# EasyEDA Pro project 硬件.epro

# Schematic Schematic1
Board Name: Board1; Create Date: 2025-05-08; Page Name: P1; Project Name: TV-Pro双固件在线大模型小电视-修改; Schematic Name: Schematic1; Update Date: 2025-05-08; Company: 嘉立创EDA; Page Size: A4; Version: V1.0
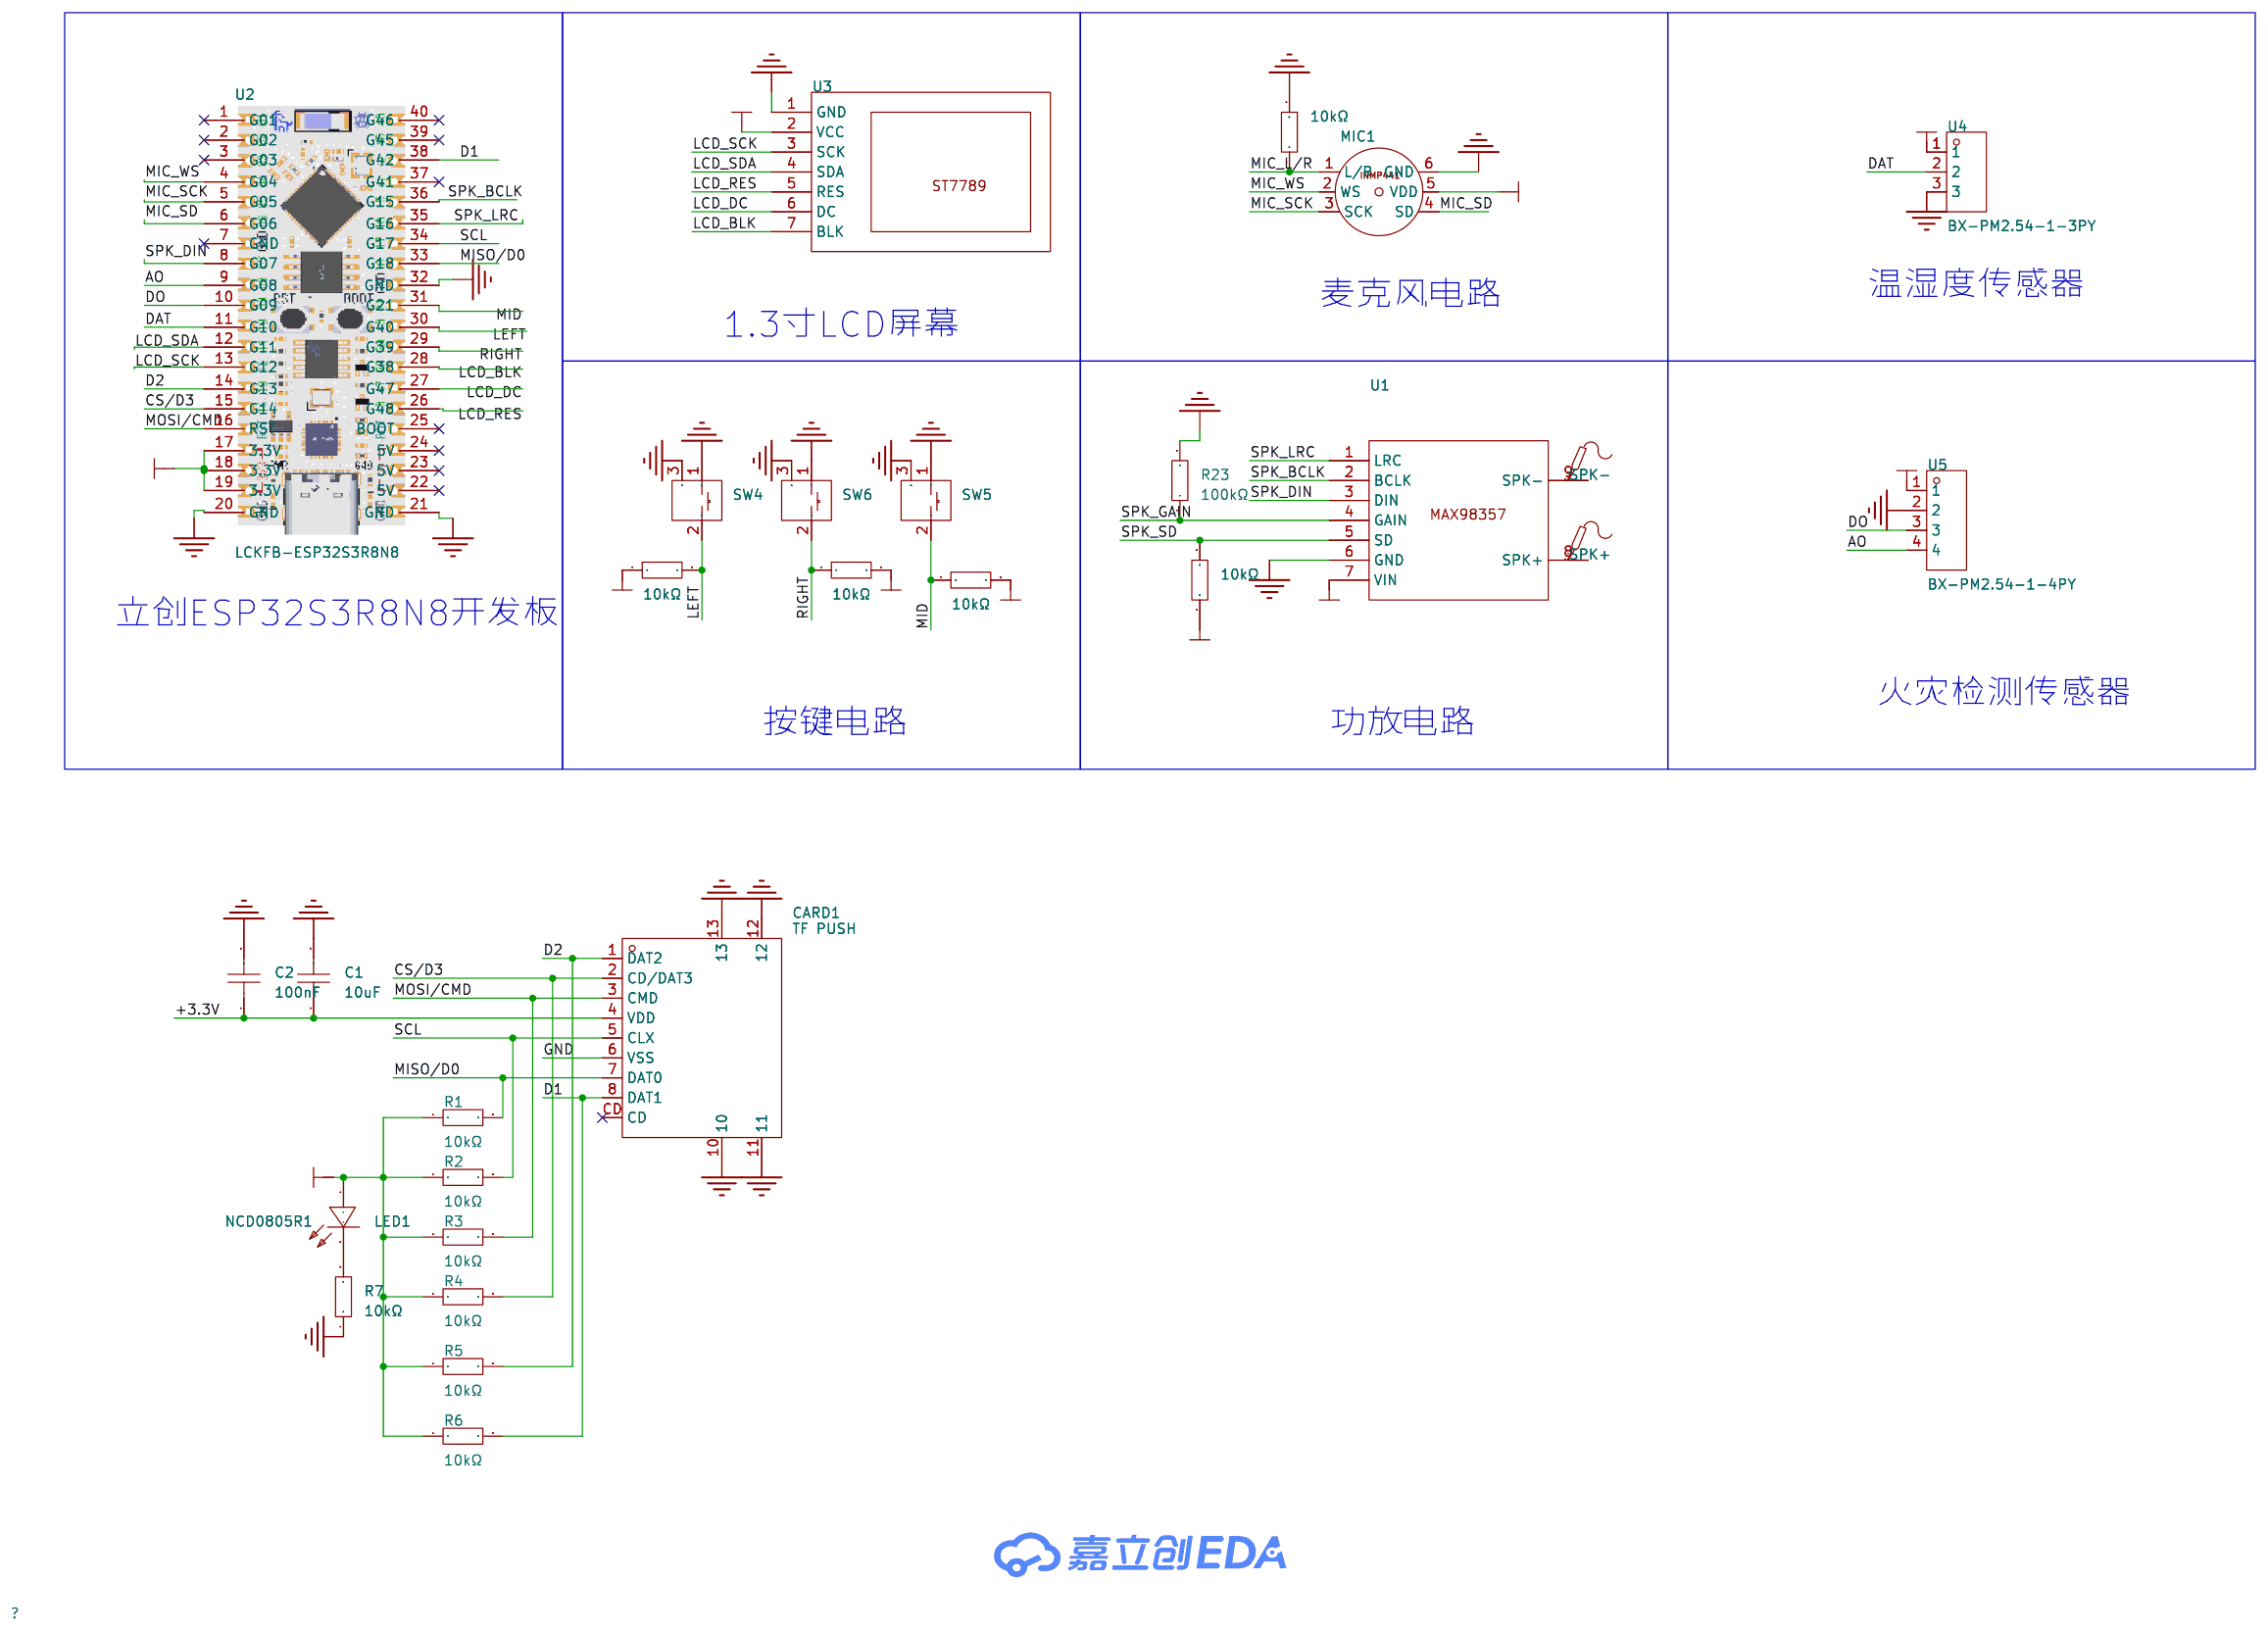
[diagram p0: schematic sheet]

## Parts
C1  10uF  [C0805]
C2  100nF  [C0805]
CARD1  TF PUSH  [TF-SMD_TF-PUSH]
LED1  NCD0805R1  [LED0805-R-RD]
MIC1  -  [COMM-TH_INMP441]
R1  10kΩ  [R0805]
R2  10kΩ  [R0805]
R3  10kΩ  [R0805]
R4  10kΩ  [R0805]
R5  10kΩ  [R0805]
R6  10kΩ  [R0805]
R7  10kΩ  [R0805]
R17  10kΩ  [RES-TH_BD2.4-L6.3-P10.30-D0.6]
R18  10kΩ  [RES-TH_BD2.4-L6.3-P10.30-D0.6]
R19  10kΩ  [RES-TH_BD2.4-L6.3-P10.30-D0.6]
R20  10kΩ  [RES-TH_BD2.4-L6.3-P10.30-D0.6]
R22  10kΩ  [RES-TH_BD2.4-L6.3-P10.30-D0.6]
R23  100kΩ  [RES-TH_BD2.4-L6.3-P10.30-D0.6]
SPK+  -  [Test-Point-0.5mm]
SPK-  -  [Test-Point-0.5mm]
SW4  K2-1109DE-G4SW-04  [KEY-TH_3P-L4.5-W6.5-P3.00]
SW5  K2-1109DE-G4SW-04  [KEY-TH_3P-L4.5-W6.5-P3.00]
SW6  K2-1109DE-G4SW-04  [KEY-TH_3P-L4.5-W6.5-P3.00]
U1  -  [MAX98357]
U2  LCKFB-ESP32S3R8N8  [DIP-40_L20.32-W51.66-P2.54-LS15.24]
U3  -  [1.3-LCD-TFT-SPI-MODULE]
U4  BX-PM2.54-1-3PY  [HDR-TH_3P-P2.54-V-F]
U5  BX-PM2.54-1-4PY  [HDR-TH_4P-P2.54-V-F]

## Library data of the parts
C1 C2 = CL21A106KAYNNNE_C15850: 容值:10uF;精度:±10%;额定电压:25V;材质(温度系数):X5R;; LCSC Part Name: 10uF ±10% 25V; Supplier Part: C15850; Manufacturer: SAMSUNG(三星); Manufacturer Part: CL21A106KAYNNNE; Supplier Footprint: 0805; JLCPCB Part Class: Basic Part; Datasheet: https://atta.szlcsc.com/upload/public/pdf/source/20160218/1457707763339.pdf; Supplier: LCSC; Tolerance: ±10%; Voltage Rated: 25V; Temperature Coefficient: X5R
CARD1 = TF PUSH: 卡连接方式:自弹式;卡类型:MicroSD卡(TF卡);连接器类型:卡座;本体最大高度:2mm;触头材质:-;触头镀层:-;工作温度范围:-20℃~+90℃;焊接温度(最大值):-;; LCSC Part Name: 自弹式 MicroSD卡(TF卡) 卡座; Supplier Part: C393941; Manufacturer: SHOU HAN(首韩); Supplier Footprint: SMD; JLCPCB Part Class: 扩展库; Datasheet: https://atta.szlcsc.com/upload/public/pdf/source/20191011/C393941_0DDD896EE907FEB750D8B7B8982E2A67.pdf; Supplier: LCSC; Card Connection Mode: 自弹式; Card Type: MicroSD卡(TF卡); Connector Type: 卡座; Maximum Body Height: 2mm; Operating Temperature Range: -20℃~+90℃; Additional Card Detection Pins: 无
LED1 = NCD0805R1: 灯头类型:-;发光颜色:红色;正向电压(VF):1.6V~2.6V;功率:65mW;正向电流:20mA;主波长:615nm~630nm;二极管配置:独立二极管;透镜颜色:无色透明透镜;色温:-;发光强度:67mcd~195mcd;发光角度:130°;载带方式:-;工作温度:-30℃~+85℃;; Supplier Part: C84256; Manufacturer: 国星光电; Supplier Footprint: 0805; JLCPCB Part Class: Basic Part; Datasheet: https://atta.szlcsc.com/upload/public/pdf/source/20200820/C84256_F0A75A43B3EAD75808600A0514C76B99.pdf; Supplier: LCSC; Emitted Color: 红色; Forward Voltage (VF): 1.6V~2.6V; Power Dissipation: 65mW; Forward Current: 20mA; Dominant Wavelength: 615nm~630nm; Diode Configuration: 独立二极管; Lens Color: 无色透明透镜; Luminous Intensity: 67mcd~195mcd; Viewing Angle: 130°; Operating Temperature: -30℃~+85℃
MIC1 = inmp441: inmp441麦克风
R1-R7 = 0805W8F1001T5E: 电阻类型:厚膜电阻;阻值:1kΩ;精度:±1%;功率:125mW;最大工作电压:150V;温度系数:±100ppm/℃;; LCSC Part Name: 1kΩ ±1% 125mW 厚膜电阻; Supplier Part: C17513; Manufacturer: UNI-ROYAL(厚声); Supplier Footprint: 0805; JLCPCB Part Class: Basic Part; Datasheet: https://atta.szlcsc.com/upload/public/pdf/source/20200306/C422600_1E6D84923E4A46A82E41ADD87F860B5C.pdf; Supplier: LCSC; Type: 厚膜电阻; Tolerance: ±1%; Power(Watts): 125mW; Overload Voltage (Max): 150V; Temperature Coefficient: ±100ppm/℃; Operating Temperature Range: -55℃~+155℃
R17-R20 R22 = RN1/4W10KFT/BA1: 电阻类型:金属膜电阻;阻值:10kΩ;精度:±1%;功率:250mW;温度系数:±50ppm/℃;; LCSC Part Name: 10kΩ ±1% 250mW 金属膜电阻; Supplier Part: C410695; Manufacturer: Tyohm(幸亚电阻); Supplier Footprint: 插件,D2.4xL6.5mm; JLCPCB Part Class: Extended Part; Datasheet: https://atta.szlcsc.com/upload/public/pdf/source/20190808/C410699_D126E64D28B638F1D73B58E9F61DFD9B.pdf; Supplier: LCSC; Type: 金属膜电阻; Tolerance: ±1%; Overload Voltage (Max): 250V; Power(Watts): 250mW; Temperature Coefficient: ±50ppm/℃; Operating Temperature Range: -55℃~+125℃
R23 = MFR-25JT-52-100K: 电阻类型:金属膜电阻;阻值:100kΩ;精度:±5%;功率:250mW;; LCSC Part Name: 金属膜电阻 100kΩ ±5% 250mW; Supplier Part: C176449; Manufacturer: YAGEO(国巨); Supplier Footprint: 插件,D2.4xL6.3mm; JLCPCB Part Class: Extended Part; Datasheet: https://atta.szlcsc.com/upload/public/pdf/source/20191118/C457825_18355E864DE4965678DC27B0EBC3E21E.pdf; Supplier: LCSC; Type: 金属膜电阻; Tolerance: ±5%; Power(Watts): 250mW; Operating Temperature: -55℃~+155℃
SPK+ SPK- = Test-Point: Test Point 测试点
SW4-SW6 = K2-1109DE-G4SW-04: 作用力:250gf;安装方式:卧插;开关长度:4.5mm;开关宽度:4.5mm;开关高度:6.5mm;触点电流:50mA;额定电压(DC):12V;绝缘电阻:100MΩ;机械寿命:10万次;; LCSC Part Name: 4.5*4.5*6.5 三脚侧插开关; Supplier Part: C2686326; Manufacturer: 韩国韩荣; Supplier Footprint: 插件; JLCPCB Part Class: 扩展库; Datasheet: https://atta.szlcsc.com/upload/public/pdf/source/20210810/329661682BA8B3C2B40574DEC7B97564.pdf; Supplier: LCSC; Operating Force: 250gf; Mounting Style: 卧插; Switch Length: 4.5mm; Switch Width: 4.5mm; Switch Height: 6.5mm; Contact Current: 50mA; Voltage Rating (DC): 12V; Insulation Resistance: 100MΩ; Mechanical Life: 10万次; Operating Temperature: -25℃~+85℃
U1 = MAX98357
U2 = LCKFB-ESP32S3R8N8: LCSC Part Name: 立创·ESP32S3R8N8 开发板; Supplier Part: C20626143; Manufacturer: 立创开发板; JLCPCB Part Class: Extended Part; Datasheet: https://atta.szlcsc.com/upload/public/pdf/source/20240305/5BD17ECD91284FC4EAAB3B5676669C6C.pdf; Supplier: LCSC
U3 = 1.3寸LCD: LCD
U4 = BX-PM2.54-1-3PY: 插孔结构:1x3P;间距:2.54mm;行距:-;圆孔/方孔:方孔;安装类型:直插;排数:单排;总孔位数:3P;额定电流:-;额定电压:1kV;插孔方向:顶部;塑高:8.5mm;触头材质:-;触头镀层:金;工作温度范围:-40℃~+105℃;焊接温度(最大值):260℃@5S;; LCSC Part Name: 1x3P 间距:2.54mm 直插; Supplier Part: C18078126; Manufacturer: Bossie(博锡); Supplier Footprint: 插件,P=2.54mm; JLCPCB Part Class: 扩展库; Datasheet: https://atta.szlcsc.com/upload/public/pdf/source/20231017/CB488C2976D1DAEBBA2D1AC954A59F69.pdf; Supplier: LCSC; Holes Structure: 1x3P; Pitch: 2.54mm; Circular Hole / Square Hole: 方孔; Mounting Type: 直插; Number of Rows: 单排; Number of Holes: 3P; Voltage Rating (Max): 1kV; Holes Direction: 顶部; Insulation Height: 8.5mm; Contact Plating: 金; Operating Temperature Range: -40℃~+105℃; Soldering Temperature(Max): 260℃@5S
U5 = BX-PM2.54-1-4PY: 插孔结构:1x4P;间距:2.54mm;行距:-;圆孔/方孔:方孔;安装类型:直插;排数:单排;总孔位数:4P;额定电流:-;额定电压:1kV;插孔方向:顶部;塑高:8.5mm;触头材质:-;触头镀层:金;工作温度范围:-40℃~+105℃;焊接温度(最大值):260℃@5S;; LCSC Part Name: 1x4P 间距:2.54mm 直插; Supplier Part: C18078127; Manufacturer: Bossie(博锡); Supplier Footprint: 插件,P=2.54mm; JLCPCB Part Class: 扩展库; Datasheet: https://atta.szlcsc.com/upload/public/pdf/source/20231017/CFB91CB968D10E00E1A43557141746F1.pdf; Supplier: LCSC; Holes Structure: 1x4P; Pitch: 2.54mm; Circular Hole / Square Hole: 方孔; Mounting Type: 直插; Number of Rows: 单排; Number of Holes: 4P; Voltage Rating (Max): 1kV; Holes Direction: 顶部; Insulation Height: 8.5mm; Contact Plating: 金; Operating Temperature Range: -40℃~+105℃; Soldering Temperature(Max): 260℃@5S

## Nets
+3.3V: C1.1 C2.1 CARD1.4(VDD) LED1.1(+) MIC1.5(VDD) R1.1 R2.1 R3.1 R4.1 R5.1 R6.1 R17.1 R18.2 R19.2 R20.1 U1.7(VIN) U2.17(3.3V) U2.18(3.3V) U2.19(3.3V) U3.2(VCC) U4.1 U5.1
GND: C1.2 C2.2 CARD1.6(VSS) CARD1.10 CARD1.11 CARD1.12 CARD1.13 MIC1.6(GND) R7.1 R22.2 R23.2 SW4.1 SW4.3 SW5.1 SW5.3 SW6.1 SW6.3 U1.6(GND) U2.20(GND) U2.21(GND) U2.32(GND) U3.1(GND) U4.3 U5.2
AO: U2.9(G08) U5.4
CS/D3: CARD1.2(CD/DAT3) R4.2 U2.15(G14)
D1: CARD1.8(DAT1) R6.2 U2.38(G42)
D2: CARD1.1(DAT2) R5.2 U2.14(G13)
DAT: U2.11(G10) U4.2
DO: U2.10(G09) U5.3
LCD_BLK: U2.28(G38) U3.7(BLK)
LCD_DC: U2.27(G47) U3.6(DC)
LCD_RES: U2.26(G48) U3.5(RES)
LCD_SCK: U2.13(G12) U3.3(SCK)
LCD_SDA: U2.12(G11) U3.4(SDA)
LEFT: R17.2 SW4.2 U2.30(G40)
MIC_L/R: MIC1.1(L/R) R22.1
MIC_SCK: MIC1.3(SCK) U2.5(G05)
MIC_SD: MIC1.4(SD) U2.6(G06)
MIC_WS: MIC1.2(WS) U2.4(G04)
MID: R19.1 SW5.2 U2.31(G21)
MISO/D0: CARD1.7(DAT0) R1.2 U2.33(G18)
MOSI/CMD: CARD1.3(CMD) R3.2 U2.16(RST)
RIGHT: R18.1 SW6.2 U2.29(G39)
SCL: CARD1.5(CLX) R2.2 U2.34(G17)
SPK_BCLK: U1.2(BCLK) U2.36(G15)
SPK_DIN: U1.3(DIN) U2.8(G07)
SPK_GAIN: R23.1 U1.4(GAIN)
SPK_LRC: U1.1(LRC) U2.35(G16)
SPK_SD: R20.2 U1.5(SD)
$1N1690: SPK-.1 U1.9(SPK-)
$1N1694: SPK+.1 U1.8(SPK+)
$1N12514: LED1.2(-) R7.2

Not connected (* = marked no-connect by the designer): CARD1 CD*; U2 1(G01)* 2(G02)* 3(G03)* 7(GND)* 22(5V)* 23(5V)* 24(5V)* 25(BOOT)* 37(G41)* 39(G45)* 40(G46)*

## Notes on the sheet
- 温湿度传感器
- 麦克风电路
- 1.3寸LCD屏幕
- 立创ESP32S3R8N8开发板
- 火灾检测传感器
- 按键电路
- 功放电路

# Board PCB1
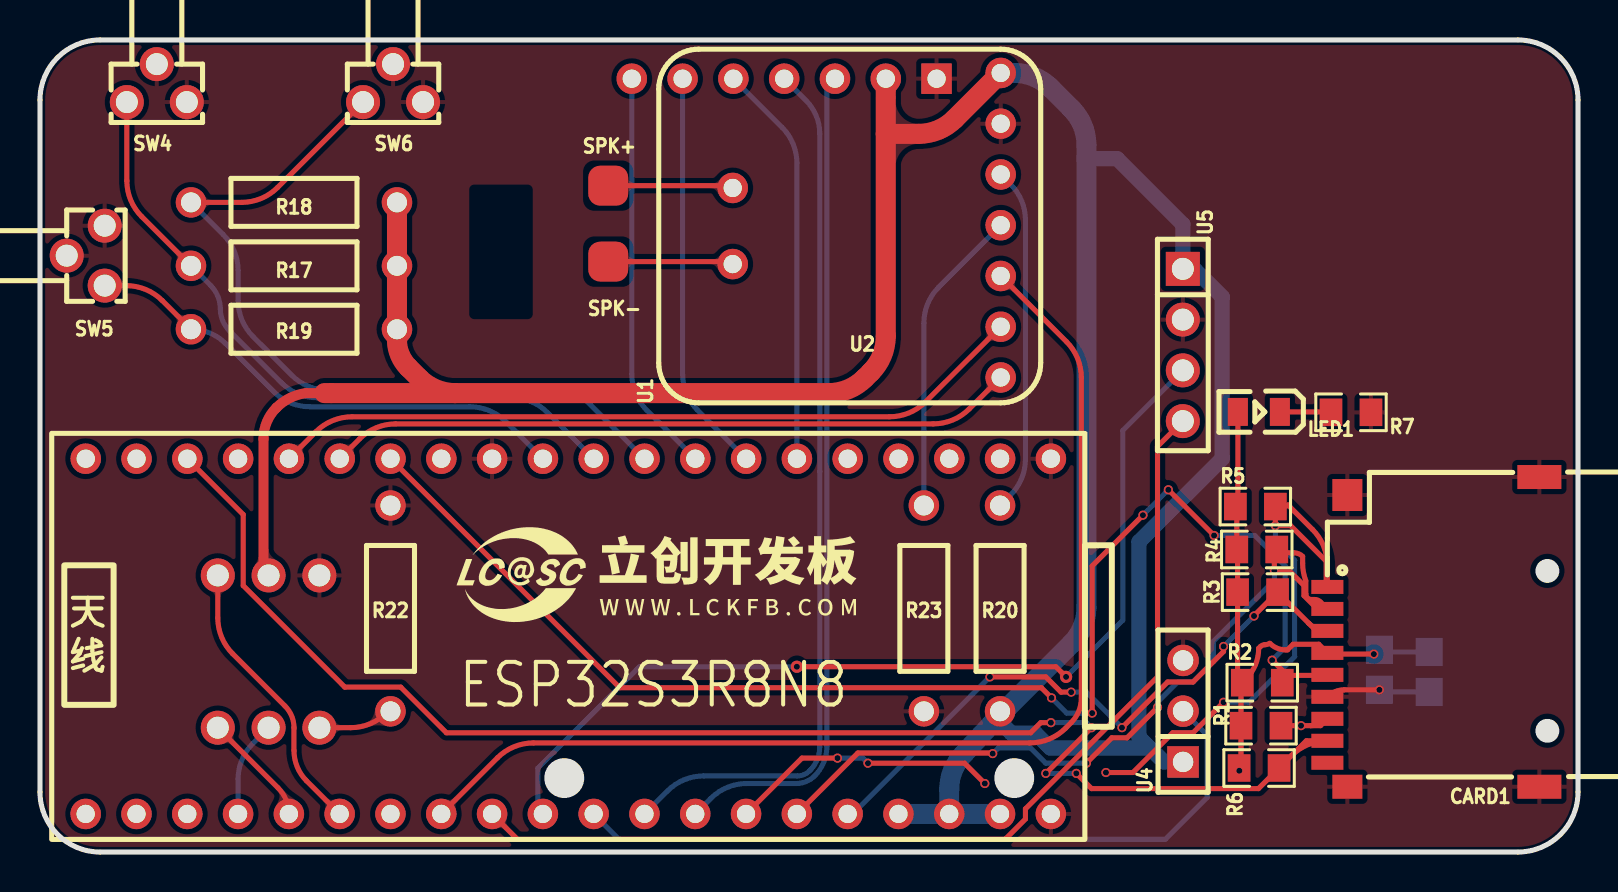
[diagram p1: board, top side]
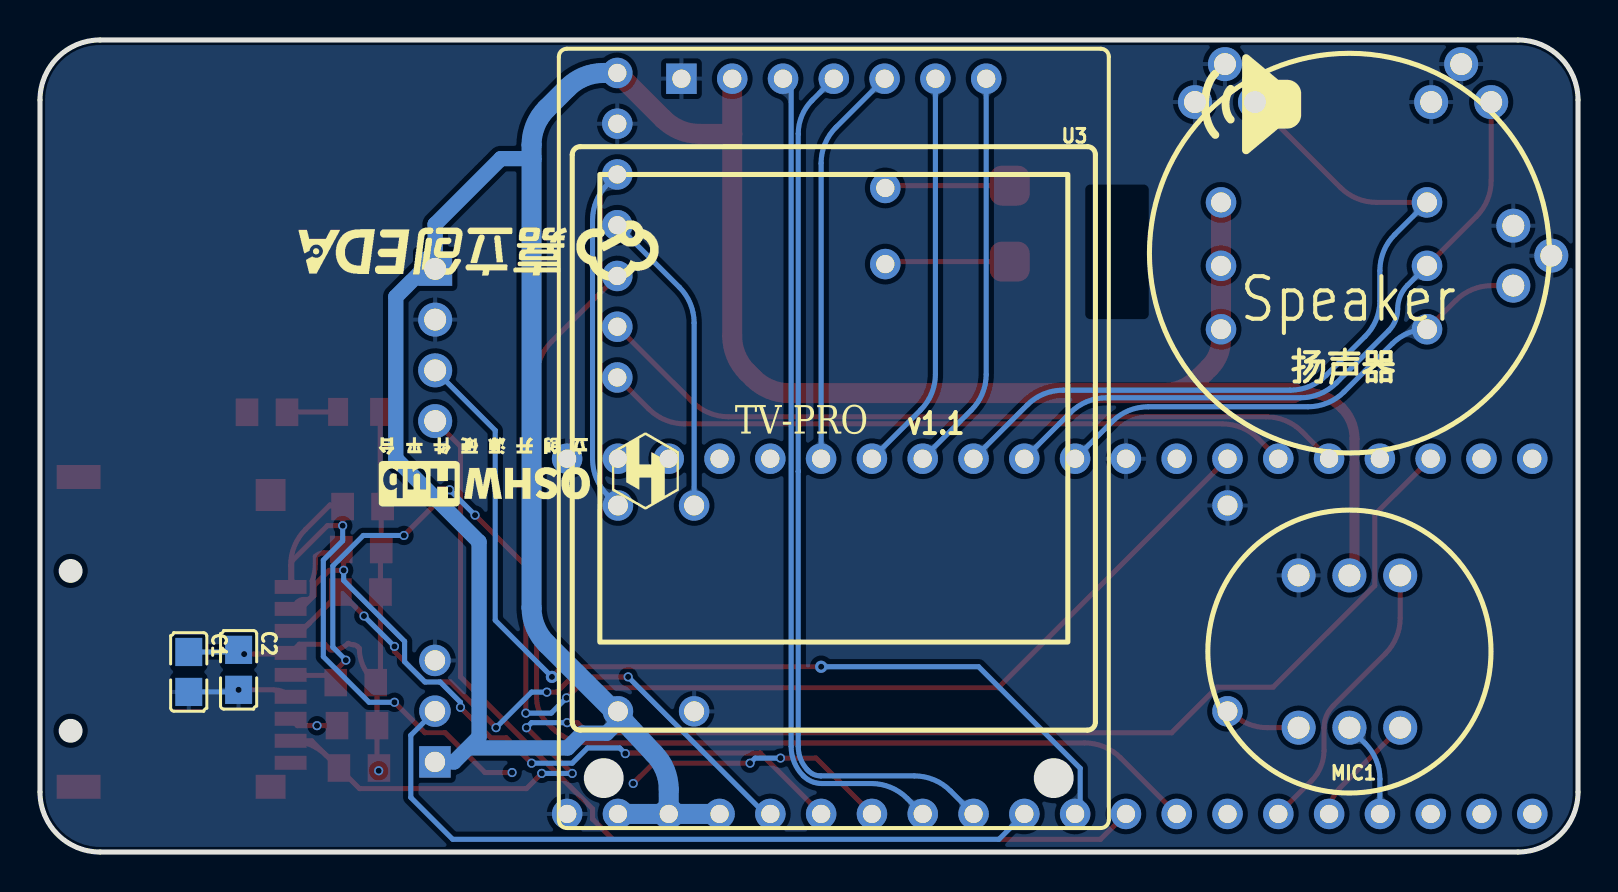
[diagram p2: board, bottom side, seen from below]

Outline 76.9 x 40.64 mm; copper layers: Top Layer, Inner1, Inner2, Bottom Layer. Coordinates in mm from the lower left corner of the outline.
Outline path: 0,37.64 0,3 arc(0.88,0.88) 3,0 73.9,0 arc(76.03,0.88) 76.9,3 76.9,37.64 arc(76.03,39.76) 73.9,40.64 3,40.64 arc(0.88,39.76) 0,37.64
Stack: Top Layer 0.035mm 外层铜厚1oz / Dielectric1 0.2104mm 7628 RC49% 8.6mil / Inner1 0.0152mm 内层铜厚 / Dielectric2 1.065mm 1.1mm H/HOZ Copper / Inner2 0.0152mm 内层铜厚 / Dielectric3 0.2104mm 7628 RC49% 8.6mil / Bottom Layer 0.035mm 外层铜厚1oz

## Design rules (mm)
template: 自定义配置
spacing copperThickness1oz (default): track to track 0.102, other pairs 0.152 to 0.3
spacing copperThickness2oz: track to track 0.203, other pairs 0.152 to 0.3
track width copperThickness1oz (default): min 0.127, default 0.254, max 2.54
track width copperThickness2oz: min 0.203, default 0.254, max 2.54
differential pair differentialPair (default): width min 0.127, default 0.254, max 2.54; gap min 0.152, default 0.152
via viaSize (default): diameter min 0.254, default 0.457, max 10; hole min 0.254, default 0.305, max 6.3

## Placement (name value [footprint] x y rotation side)
C1  10uF  [C0805]  69.47 9.01 270 bottom
C2  100nF  [C0805]  66.97 9.12 270 bottom
CARD1  TF PUSH  [TF-SMD_TF-PUSH]  69.67 11.02 90 top
LED1  NCD0805R1  [LED0805-R-RD]  60.95 22.03 180 top
MIC1  -  [COMM-TH_INMP441]  11.43 10.03 180 bottom
R1  10kΩ  [R0805]  61.05 6.33 0 top
R2  10kΩ  [R0805]  61.12 8.48 0 top
R3  10kΩ  [R0805]  60.88 13.01 0 top
R4  10kΩ  [R0805]  60.84 15.14 0 top
R5  10kΩ  [R0805]  60.77 17.29 0 top
R6  10kΩ  [R0805]  60.96 4.2 0 top
R7  10kΩ  [R0805]  65.55 22.01 180 top
R17  10kΩ  [RES-TH_BD2.4-L6.3-P10.30-D0.6]  12.7 29.34 180 top
R18  10kΩ  [RES-TH_BD2.4-L6.3-P10.30-D0.6]  12.7 32.51 0 top
R19  10kΩ  [RES-TH_BD2.4-L6.3-P10.30-D0.6]  12.7 26.16 0 top
R20  10kΩ  [RES-TH_BD2.4-L6.3-P10.30-D0.6]  48.01 12.19 90 top
R22  10kΩ  [RES-TH_BD2.4-L6.3-P10.30-D0.6]  17.53 12.19 90 top
R23  100kΩ  [RES-TH_BD2.4-L6.3-P10.30-D0.6]  44.2 12.19 270 top
SPK+  -  [Test-Point-0.5mm]  28.41 33.35 0 top
SPK-  -  [Test-Point-0.5mm]  28.41 29.55 0 top
SW4  K2-1109DE-G4SW-04  [KEY-TH_3P-L4.5-W6.5-P3.00]  5.84 38.48 180 top
SW5  K2-1109DE-G4SW-04  [KEY-TH_3P-L4.5-W6.5-P3.00]  2.29 29.84 270 top
SW6  K2-1109DE-G4SW-04  [KEY-TH_3P-L4.5-W6.5-P3.00]  17.65 38.48 180 top
U1  -  [MAX98357]  50.04 22.48 90 top
U2  LCKFB-ESP32S3R8N8  [DIP-40_L20.32-W51.66-P2.54-LS15.24]  26.42 10.8 90 top
U3  -  [1.3-LCD-TFT-SPI-MODULE]  37.21 20.7 180 bottom
U4  BX-PM2.54-1-3PY  [HDR-TH_3P-P2.54-V-F]  57.16 7.05 90 top
U5  BX-PM2.54-1-4PY  [HDR-TH_4P-P2.54-V-F]  57.14 25.38 270 top

## Footprints (pads in the part's own frame, mm; a bottom-side part is the same pattern mirrored in y, then rotated)
1.3-LCD-TFT-SPI-MODULE
  rect 1.524x1.524 hole 0.914: 1(-7.62,18)
  round 1.524 hole 0.914: 2(-5.08,18) 3(-2.54,18) 4(0,18) 5(2.54,18) 6(5.08,18) 7(7.62,18)
C0805
  rect 1.41x1.35 smd: 1(-1,0) 2(1,0)
COMM-TH_INMP441
  round 1.7 hole 1.1: 1(-2.54,-3.81) 2(0,-3.81) 3(2.54,-3.81) 4(2.54,3.81) 5(0,3.81) 6(-2.54,3.81)
DIP-40_L20.32-W51.66-P2.54-LS15.24
  round 1.524 hole 0.914: 1(-8.889,24.131) 2(-8.889,21.591) 3(-8.889,19.052) 4(-8.889,16.512) 5(-8.889,13.972) 6(-8.889,11.431) 7(-8.889,8.892) 8(-8.889,6.351) 9(-8.889,3.812) 10(-8.889,1.272) 11(-8.889,-1.268) 12(-8.889,-3.808) 13(-8.889,-6.348) 14(-8.889,-8.889) 15(-8.889,-11.428) 16(-8.889,-13.969) 17(-8.889,-16.509) 18(-8.889,-19.049) 19(-8.889,-21.588) 20(-8.889,-24.128) 21(8.889,-24.131) 22(8.889,-21.591) 23(8.889,-19.052) 24(8.889,-16.512) 25(8.889,-13.972) 26(8.889,-11.431) 27(8.889,-8.892) 28(8.889,-6.351) 29(8.889,-3.812) 30(8.889,-1.272) 31(8.889,1.268) 32(8.889,3.808) 33(8.889,6.348) 34(8.889,8.889) 35(8.889,11.428) 36(8.889,13.969) 37(8.889,16.509) 38(8.889,19.049) 39(8.889,21.588) 40(8.889,24.128)
HDR-TH_3P-P2.54-V-F
  rect 1.575x1.575 hole 1.02: 1(-2.54,0)
  round 1.575 hole 1.02: 2(0,0) 3(2.54,0)
HDR-TH_4P-P2.54-V-F
  rect 1.7x1.7 hole 1.1: 1(-3.81,0)
  round 1.7 hole 1.1: 2(-1.27,0) 3(1.27,0) 4(3.81,0)
KEY-TH_3P-L4.5-W6.5-P3.00
  round 1.7 hole 1.1: 1(-1.5,0.95) 2(1.5,0.95) 3(0,-0.95)
LED0805-R-RD
  rect 1x1.399 smd: 1(1.05,0) 2(-1.05,0)
MAX98357
  round 1.524 hole 0.914: 1(1.27,2) 2(3.81,2) 3(6.35,2) 4(8.89,2) 5(11.43,2) 6(13.97,2) 7(16.51,2) 8(10.755,15.4) 9(6.945,15.4)
R0805
  rect 1.133x1.377 smd: 1(-1,0) 2(1,0)
RES-TH_BD2.4-L6.3-P10.30-D0.6
  round 1.524 hole 1: 1(-5.15,0) 2(5.15,0)
Test-Point-0.5mm
  rrect 2x2 smd: 1(0,0)
TF-SMD_TF-PUSH
  rect 0.7x1.6 smd: 1(2.25,5.3) 2(1.15,5.3) 3(0.05,5.3) 4(-1.05,5.3) 5(-2.15,5.3) 6(-3.25,5.3) 7(-4.35,5.3) 8(-5.45,5.3) CD(-6.55,5.3)
  rect 1.2x1.5 smd: 10(-7.75,4.3)
  rect 1.2x2.2 smd: 11(-7.75,-5.3) 12(7.75,-5.3)
  rect 1.6x1.5 smd: 13(6.85,4.3)

## Nets
As in the schematic.

Pads without a net: CARD1 CD; U2 1 2 3 7 22 23 24 25 37 39 40

## Via types
v1: diameter 0.457, hole 0.305, Top Layer to Bottom Layer, 29 vias
v2: diameter 0.61, hole 0.305, Top Layer to Bottom Layer, 2 vias

## Routing (per net, layer and track width the routed paths; a pad name or vN(x,y) marks a point on that pad's centre or on a via; arc(x,y) is an arc through that point)
+3.3V: length 202.3
  Top Layer w0.254: v1(66.7,9.91) 64.52,9.91 arc(64.44,9.92) CARD1.4 63.94,10.4 62.66,10.4 62.38,10.12 62.27,10.12 arc(61.86,10.2) 61.51,10.44 ; LED1.1 59.9,17.59 arc(59.86,17.43) R5.1 arc(59.82,17.21) 59.84,17.11 R4.1 arc(59.87,15.1) 59.88,15.05 R3.1 59.88,9.05 arc(59.94,8.74) R2.1 ; R2.1 60.3,8.66 arc(60.77,9.37) 60.94,10.2 61.03,10.28 arc(61.13,10.35) 61.24,10.38 arc(61.37,10.39) 61.49,10.45 ; R2.1 arc(60.07,8.41) 60.05,8.32 R1.1 60.05,4.44 arc(60.03,4.31) R6.1 ; 11.25,14.03 MIC1.5
  Top Layer w0.5: 11.18,13.97 11.18,20.69 arc(11.34,21.52) 11.81,22.22 11.83,22.24 arc(12.51,22.73) 13.31,22.97 14.15,22.97 ; 14.56,22.97 arc(14.58,22.97) 14.6,22.99
  Top Layer w1: R18.2 R17.1 17.85,25.62 arc(18,24.88) 18.41,24.26 18.96,23.71 arc(19.79,23.16) 20.76,22.97 ; 20.76,22.97 39.44,22.97 arc(40.41,23.16) 41.24,23.71 41.55,24.02 arc(42.1,24.84) 42.29,25.82 42.29,35.94 ; 20.76,22.97 14.22,22.97 ; U1.7 45.73,36.69 arc(44.91,36.13) 43.94,35.94 42.29,35.94 ; 42.29,35.94 U3.2
  Inner1 w0.254: v1(59.97,4.07) 58.22,4.07 arc(57.65,4.18) U4.1
  Bottom Layer w0.254: 48.73,38.99 49.95,38.99 52.32,36.61 52.32,35.4 ; U4.1 56.58,4.51 ; C1.1 67.23,10.01 arc(67.09,10.04) C2.1
  Bottom Layer w0.762: 48,6.86 48,6.51 48.57,5.95 49.78,5.95 50.51,5.21 55.37,5.21 ; 52.32,34.7 53.86,34.7 57.14,31.41 U5.1 57.71,29.19 59.11,27.78 59.11,19.69 54.95,15.52 54.95,5.76 56.2,4.51 56.58,4.51
  Bottom Layer w1: U2.18 45.46,3.14 arc(45.66,4.11) 46.21,4.93 47.94,6.79 51.58,10.43 arc(52.13,11.26) 52.32,12.23 52.32,35.4 arc(52.13,36.37) 51.58,37.19 50.53,38.25 arc(49.7,38.8) 48.73,38.99 U1.7 ; U2.18 U2.19 ; U2.18 U2.17
GND: length 5.2
  Top Layer w0.254: v1(66.97,8.12) 65.22,8.12 arc(64.76,8.03) CARD1.6
  Bottom Layer w0.254: C1.2 67.23,8.01 arc(67.09,8.04) v1(66.97,8.12)
AO: length 50.8
  Top Layer w0.254: U5.4 55.88,20.3 55.88,8.76 49.27,2.16 49.27,1.65 48.26,0.64 23.87,0.64 U2.9
CS/D3: length 40.2
  Top Layer w0.254: U2.15 40.89,4.95 47.61,4.95 v1(47.64,4.93) ; v1(52.32,4.45) 53.59,5.72 54.35,5.72 v1(55.88,7.24) ; v1(61.72,14.1) 62.44,14.1 63.2,13.34 63.2,12.83 63.86,12.17 CARD1.2 64.02,12.52 arc(63.89,12.61) 63.74,12.64 63.57,12.64 arc(63.38,12.72) 63.29,12.92 63.29,13.57 arc(63.18,14.01) 63.13,14.46 63.13,14.8 arc(62.94,14.93) 62.7,14.97 62.24,14.97 arc(62.03,15.02) R4.2 61.72,15.02 v1(61.72,14.1)
  Bottom Layer w0.254: v1(55.88,7.24) 55.88,7.49 56.89,8.51 57.66,8.51 58.67,9.53 58.67,10.54 61.72,13.59 v1(61.72,14.1) ; v1(47.64,4.93) 47.92,5.21 49.53,5.21 50.29,4.45 v1(52.32,4.45)
D1: length 73.9
  Top Layer w0.254: 64.37,5.57 CARD1.8 ; 64.37,5.57 63.32,5.57 62.58,4.82 ; 64.37,5.57 arc(63.4,5.37) 62.58,4.82 ; 62.58,4.82 R6.2 60.93,3.17 52.58,3.17 v1(51.82,3.94) ; v1(52.58,6.22) v1(50.29,3.94) ; U2.38 10.16,16.89 10.16,13.33 15.24,8.25 18.04,8.25 20.32,5.97 49.53,5.97 50.04,6.48 v1(50.55,6.48)
  Bottom Layer w0.254: v1(52.58,6.22) 52.33,6.48 v1(50.55,6.48) ; v1(50.29,3.94) v1(51.82,3.94)
D2: length 53.5
  Top Layer w0.254: v1(59.18,7.49) 57.66,5.97 56.64,5.97 54.65,3.98 v1(53.3,3.98) ; v1(47.24,3.43) 46.23,4.45 v1(41.4,4.45) ; v1(39.88,4.7) 38.1,4.7 U2.14 ; 63.63,16.14 62.4,17.37 arc(62.32,17.31) 62.22,17.29 R5.2 v1(61.77,16.33) 62.53,16.33 64.31,14.56 64.31,13.33 CARD1.1 64.37,14.35 arc(64.18,15.32) 63.63,16.14
  Inner1 w0.254: v1(53.3,3.98) arc(53.27,4.15) 53.17,4.29 52.76,4.7 arc(52.68,4.81) 52.57,4.89 52.19,5.27 arc(51.66,5.63) 51.04,5.75 47.31,5.75 arc(46.85,5.66) 46.46,5.4 arc(46.33,5.2) 46.28,4.97 46.84,4.41 arc(47.14,3.96) v1(47.24,3.43)
  Bottom Layer w0.254: v1(61.77,16.33) 61.77,15.57 62.74,14.61 62.74,9.78 60.45,7.49 v1(59.18,7.49) ; v1(39.88,4.7) 41.15,4.7 v1(41.4,4.45)
DAT: length 36.9
  Bottom Layer w0.254: U2.11 28.95,0.64 56.27,0.64 58.36,2.73 58.36,5.84 U4.2
DO: length 48.9
  Top Layer w0.254: v2(51.31,8.76) 50.8,9.27 v2(37.84,9.27)
  Bottom Layer w0.254: v2(37.84,9.27) 29.97,9.27 24.89,4.19 24.89,2.16 U2.10 ; v2(51.31,8.76) 54.14,11.6 54.14,21.1 U5.3
LCD_BLK: length 20.2
  Bottom Layer w0.254: U2.28 30.34,22.12 arc(29.78,22.94) 29.59,23.91 U3.7
LCD_DC: length 20.2
  Bottom Layer w0.254: U3.6 32.13,23.91 arc(32.32,22.94) 32.88,22.12 U2.27
LCD_RES: length 20.2
  Bottom Layer w0.254: U3.5 37.1,36.27 arc(37.65,35.44) 37.85,34.47 U2.26
LCD_SCK: length 41.8
  Bottom Layer w0.254: U2.13 33.54,2.69 arc(34.37,3.24) 35.34,3.43 37.81,3.43 arc(38.31,3.53) 38.73,3.81 arc(39.19,4.49) 39.35,5.29 39.35,38.3 U3.3
LCD_SDA: length 44.4
  Bottom Layer w0.254: 38.99,19.05 38.99,35.95 arc(38.81,36.85) 38.3,37.61 U3.4 ; 38.99,19.05 38.99,5.29 arc(38.88,4.67) 38.56,4.14 38.48,4.06 arc(38.2,3.88) 37.87,3.81 33.18,3.81 arc(32.21,3.62) 31.38,3.07 U2.12 ; 38.99,19.05 arc(38.99,19.05) 38.99,19.05
LEFT: length 34
  Top Layer w0.254: SW4.2 4.34,33.6 arc(4.54,32.62) 5.09,31.8 7.55,29.34
  Bottom Layer w0.254: 7.55,29.34 8.53,28.36 arc(8.89,27.82) 9.02,27.18 arc(9.13,26.59) 9.47,26.09 12.08,23.48 arc(12.91,22.93) 13.88,22.73 23.59,22.73 arc(24.56,22.54) 25.38,21.99 U2.30
MIC_L/R: length 3.8
  Top Layer w0.254: MIC1.1 15.53,6.22 arc(16.5,6.42) 17.32,6.97 17.53,7.17
MIC_SCK: length 5.7
  Top Layer w0.254: 8.89,6.22 11.91,3.21 arc(12.3,2.61) U2.5
MIC_SD: length 14.2
  Top Layer w0.254: U2.6 13.33,3.56 arc(12.86,4.26) 12.7,5.08 12.7,6.22 arc(12.58,6.81) 12.25,7.31 9.63,9.92 arc(9.08,10.75) 8.89,11.72 8.89,13.84
MIC_WS: length 4.8
  Bottom Layer w0.254: U2.4 9.9,3.65 arc(10.1,4.62) 10.65,5.44 MIC1.2
MID: length 25.1
  Top Layer w0.254: 3.24,28.34 4.31,28.34 arc(5.29,28.15) 6.11,27.6 7.55,26.16
  Bottom Layer w0.254: U2.31 23.29,21.54 arc(22.47,22.09) 21.5,22.28 13.5,22.28 arc(12.52,22.48) 11.7,23.03 9.28,25.44 arc(8.49,25.98) 7.55,26.16
MISO/D0: length 54.6
  Top Layer w0.254: 63.55,6.33 v1(63.05,6.33) R1.2 ; 63.55,6.33 64.03,6.33 CARD1.7 arc(63.99,6.41) 63.55,6.33
  Inner1 w0.254: v1(63.05,6.33) 60.41,8.97 arc(59.86,9.79) 59.67,10.76 59.67,13.06 56.94,15.79 arc(56.28,16.26) 55.52,16.51 arc(55.13,16.35) 54.76,16.54 48.67,16.54 arc(48.01,16.3) 47.35,16.54 44.86,16.54 arc(44.2,16.3) 43.54,16.54 21.88,16.54 20.81,17.61 arc(20.26,18.43) 20.07,19.4 U2.33
MOSI/CMD: length 32.7
  Top Layer w0.254: v1(47.5,8.76) 50.29,8.76 51.05,8 v1(51.56,8) ; v1(54.1,6.22) 56.39,8.51 57.66,8.51 59.18,10.03 v1(59.18,10.29) ; 63.43,11.46 R3.2 60.7,11.83 v1(60.7,11.81) ; 63.43,11.46 63.82,11.07 CARD1.3 arc(63.86,11.17) 63.43,11.46
  Bottom Layer w0.254: v1(59.18,10.29) v1(60.7,11.81) ; v1(47.5,8.76) 40.64,1.91 U2.16 ; v1(51.56,8) 52.32,8 v1(54.1,6.22)
RIGHT: length 40.2
  Top Layer w0.254: 7.55,32.51 10.08,32.51 arc(11.05,32.71) 11.88,33.26 SW6.2
  Bottom Layer w0.254: U2.29 27.54,22.37 arc(26.72,22.92) 25.75,23.11 14.39,23.11 arc(13.41,23.31) 12.59,23.86 10.65,25.8 arc(10.1,26.62) 9.91,27.59 9.91,29.1 arc(9.71,30.08) 9.16,30.9 7.55,32.51
SCL: length 69.2
  Top Layer w0.254: v1(50.58,7.71) 50.07,8.22 28.99,8.22 U2.34 ; v1(61.61,9.6) 62.12,9.09 62.12,8.84 ; 62.12,8.84 64.34,8.84 ; 62.12,8.84 R2.2 ; 64.34,8.84 CARD1.5 arc(64.36,8.85) 64.34,8.84 ; v1(56.42,18.13) v1(58.71,15.84) ; v1(52.61,6.95) 52.61,14.32 v1(55.15,16.86)
  Bottom Layer w0.254: v1(52.61,6.95) 51.34,6.95 v1(50.58,7.71) ; v1(55.15,16.86) v1(56.42,18.13) ; v1(58.71,15.84) 60.74,15.84 62.26,14.32 62.26,10.25 v1(61.61,9.6)
SPK_BCLK: length 38.1
  Top Layer w0.254: U2.36 13.8,21.04 arc(14.63,21.59) 15.6,21.78 42.48,21.78 arc(43.45,21.98) 44.28,22.53 U1.2
SPK_DIN: length 57.2
  Top Layer w0.254: U1.3 51.33,25.54 arc(51.88,24.72) 52.07,23.75 52.07,7.7 arc(51.94,7.04) 51.56,6.48 51.29,6.2 arc(50.47,5.65) 49.49,5.46 24.67,5.46 arc(23.7,5.27) 22.88,4.72 U2.8
SPK_GAIN: length 15.4
  Bottom Layer w0.254: 44.2,17.44 44.2,26.47 arc(44.39,27.45) 44.94,28.27 U1.4
SPK_LRC: length 34.5
  Top Layer w0.254: U2.35 15.99,20.68 arc(16.81,21.23) 17.78,21.43 44.66,21.43 arc(45.64,21.62) 46.46,22.17 U1.1
SPK_SD: length 17.4
  Bottom Layer w0.254: R20.2 48.53,17.87 arc(49.08,18.69) 49.28,19.66 49.28,31.62 arc(49.08,32.59) 48.53,33.41 U1.5
$1N1690: length 6.3
  Top Layer w0.254: SPK-.1 34.34,29.55 arc(34.5,29.52) 34.64,29.42
$1N1694: length 6.3
  Top Layer w0.254: SPK+.1 34.36,33.35 arc(34.51,33.32) 34.64,33.23
$1N12514: length 2.6
  Top Layer w0.254: LED1.2 64.5,22.03 arc(64.53,22.02) R7.2

## Copper pours and planes (outline as drawn; the poured copper is in the pictures)
GND on Top Layer: -7.72,47.63 84.84,47.63 84.84,-7.28 -7.72,-7.28
GND on Bottom Layer: -9.27,47.63 88.14,47.63 88.14,-7.67 -9.27,-7.67

Small or netless copper shapes (teardrops, artwork), in the pictures only: 34 on Top Layer, 34 on Bottom Layer

## Text on the board
Bottom Silkscreen Layer: v1.1 | Speaker | 扬声器 | TV-PRO
Top Silkscreen Layer: ESP32S3R8N8 | 天 / 线
